# Altium schematic sheet EDU_High-Speed-Design_Overview.SchDoc: Overview
size 431 x 279 mm; Date: not used; ApprovedBy: not used; CheckedBy: not used; Author: not used; DrawnBy: not used; Organization: not used; Address4: not used; SheetNumber: 1; SheetTotal: 26; Time: not used; ImagePath: not used; Application_BuildNumber: not used
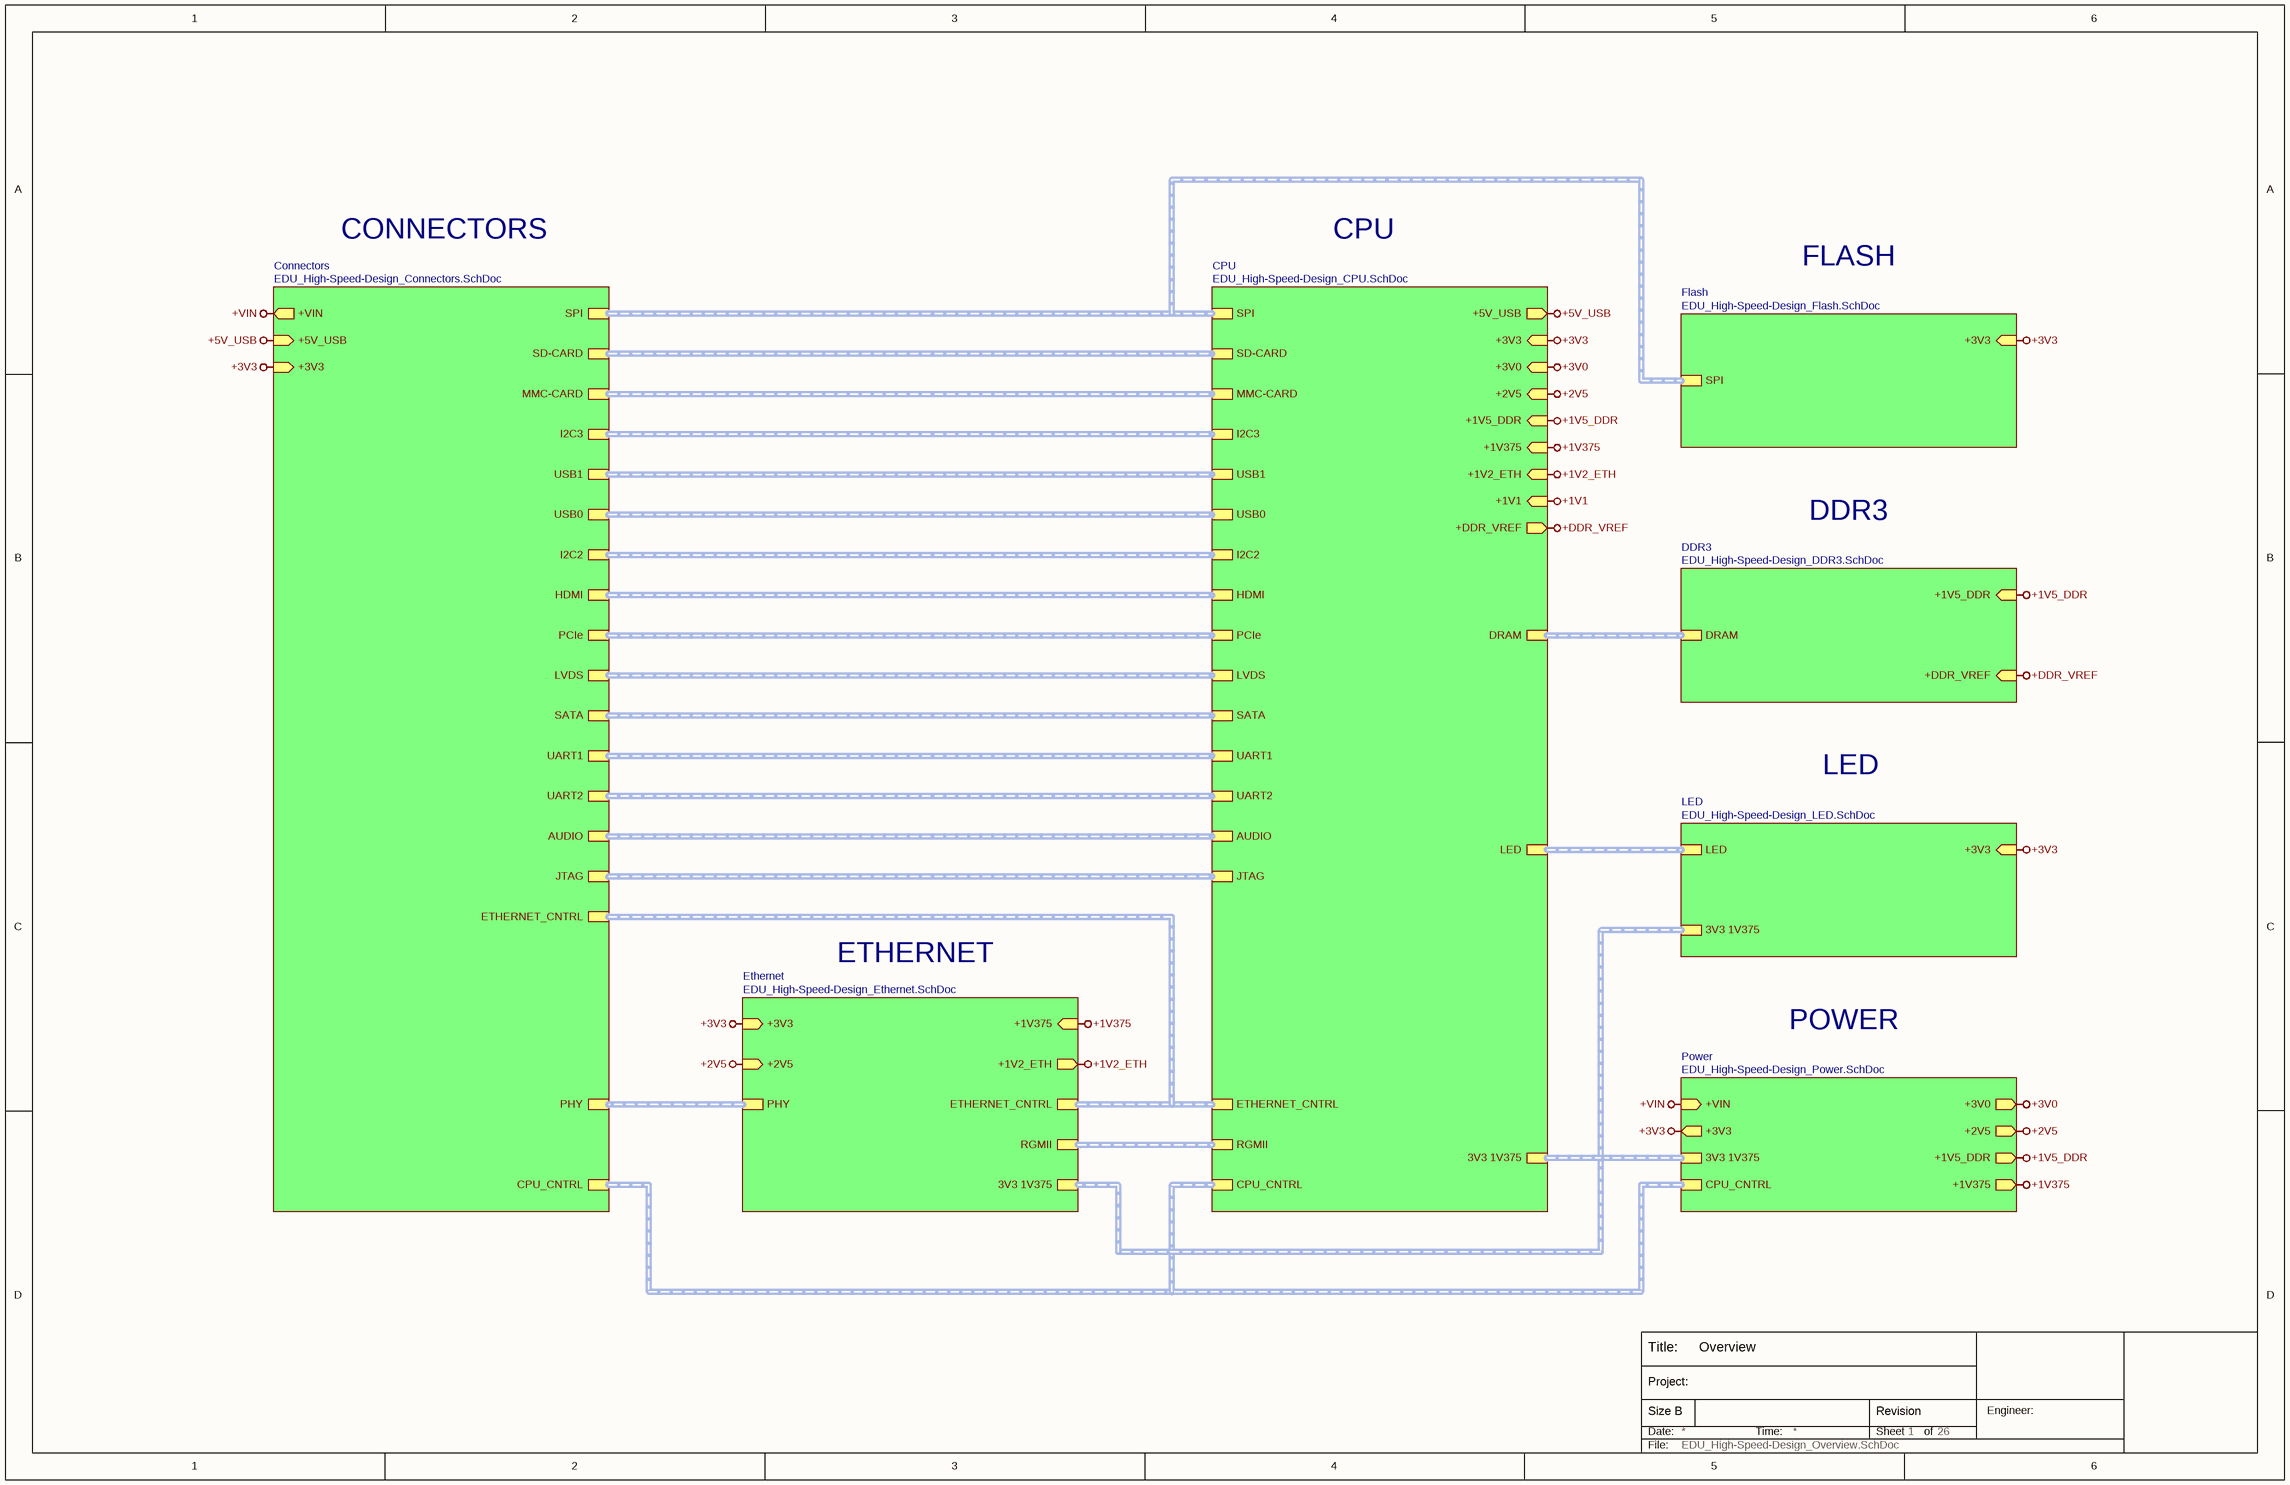
[diagram p0: EDU_High-Speed-Design_Overview.SchDoc]

## Sub-sheets
Connectors = EDU_High-Speed-Design_Connectors.SchDoc: +VIN (out), +5V_USB (in), +3V3 (in), JTAG (harness JTAG), CPU_CNTRL (harness CPU_CNTRL), AUDIO (harness AUDIO), UART2 (harness UART2), UART1 (harness UART1), SATA (harness SATA), LVDS (harness LVDS), PCIe (harness PCIe), HDMI (harness HDMI), I2C2 (harness I2C2), USB0 (harness USB0), USB1 (harness USB1), SPI (harness SPI), I2C3 (harness I2C3), MMC-CARD (harness MMC-CARD), SD-CARD (harness SD-CARD), PHY (harness PHY), ETHERNET_CNTRL (harness ETHERNET_CNTRL)
CPU = EDU_High-Speed-Design_CPU.SchDoc: +3V3 (in), +3V0 (in), +2V5 (in), +1V375 (in), +1V2_ETH (in), RGMII (harness RGMII), JTAG (harness JTAG), CPU_CNTRL (harness CPU_CNTRL), UART1 (harness UART1), UART2 (harness UART2), AUDIO (harness AUDIO), ETHERNET_CNTRL (harness ETHERNET_CNTRL), USB1 (harness USB1), USB0 (harness USB0), LVDS (harness LVDS), I2C3 (harness I2C3), HDMI (harness HDMI), I2C2 (harness I2C2), SATA (harness SATA), PCIe (harness PCIe), DRAM (harness DRAM), MMC-CARD (harness MMC-CARD), SPI (harness SPI), +5V_USB (out), LED (harness LED), +1V1 (in), SD-CARD (harness SD-CARD), +1V5_DDR (in), +DDR_VREF (out), 3V3 1V375 (harness 3V3 1V375)
DDR3 = EDU_High-Speed-Design_DDR3.SchDoc: +1V5_DDR (in), DRAM (harness DRAM), +DDR_VREF (in)
Ethernet = EDU_High-Speed-Design_Ethernet.SchDoc: RGMII (harness RGMII), +3V3 (in), PHY (harness PHY), +2V5 (in), ETHERNET_CNTRL (harness ETHERNET_CNTRL), +1V2_ETH (out), +1V375 (in), 3V3 1V375 (harness 3V3 1V375)
Flash = EDU_High-Speed-Design_Flash.SchDoc: +3V3 (in), SPI (harness SPI)
LED = EDU_High-Speed-Design_LED.SchDoc: +3V3 (in), LED (harness LED), 3V3 1V375 (harness 3V3 1V375)
Power = EDU_High-Speed-Design_Power.SchDoc: +2V5 (out), +VIN (in), +3V3 (out), 3V3 1V375 (harness 3V3 1V375), +3V0 (out), +1V375 (out), +1V5_DDR (out), CPU_CNTRL (harness CPU_CNTRL)

## Nets
+1V1: sheet CPU/+1V1
+1V2_ETH: sheet CPU/+1V2_ETH, sheet Ethernet/+1V2_ETH
+1V5_DDR: sheet CPU/+1V5_DDR, sheet DDR3/+1V5_DDR, sheet Power/+1V5_DDR
+1V375: sheet CPU/+1V375, sheet Ethernet/+1V375, sheet Power/+1V375
+2V5: sheet CPU/+2V5, sheet Ethernet/+2V5, sheet Power/+2V5
+3V0: sheet CPU/+3V0, sheet Power/+3V0
+3V3: sheet CPU/+3V3, sheet Connectors/+3V3, sheet Ethernet/+3V3, sheet Flash/+3V3, sheet Power/+3V3, sheet LED/+3V3
+5V_USB: sheet CPU/+5V_USB, sheet Connectors/+5V_USB
+DDR_VREF: sheet CPU/+DDR_VREF, sheet DDR3/+DDR_VREF
+VIN: sheet Connectors/+VIN, sheet Power/+VIN

## Buses and harness runs
harness sheet Connectors/AUDIO = sheet CPU/AUDIO
harness sheet Connectors/CPU_CNTRL = sheet CPU/CPU_CNTRL = sheet Power/CPU_CNTRL
harness sheet Connectors/ETHERNET_CNTRL = sheet CPU/ETHERNET_CNTRL = sheet Ethernet/ETHERNET_CNTRL
harness sheet Connectors/HDMI = sheet CPU/HDMI
harness sheet Connectors/I2C2 = sheet CPU/I2C2
harness sheet Connectors/I2C3 = sheet CPU/I2C3
harness sheet Connectors/JTAG = sheet CPU/JTAG
harness sheet Connectors/LVDS = sheet CPU/LVDS
harness sheet Connectors/MMC-CARD = sheet CPU/MMC-CARD
harness sheet Connectors/PCIe = sheet CPU/PCIe
harness sheet Connectors/PHY = sheet Ethernet/PHY
harness sheet Connectors/SATA = sheet CPU/SATA
harness sheet Connectors/SD-CARD = sheet CPU/SD-CARD
harness sheet Connectors/SPI = sheet CPU/SPI = sheet Flash/SPI
harness sheet Connectors/UART1 = sheet CPU/UART1
harness sheet Connectors/UART2 = sheet CPU/UART2
harness sheet Connectors/USB0 = sheet CPU/USB0
harness sheet Connectors/USB1 = sheet CPU/USB1
harness sheet CPU/3V3 1V375 = sheet Ethernet/3V3 1V375 = sheet LED/3V3 1V375 = sheet Power/3V3 1V375
harness sheet CPU/DRAM = sheet DDR3/DRAM
harness sheet CPU/LED = sheet LED/LED
harness sheet CPU/RGMII = sheet Ethernet/RGMII

## Notes on the sheet
- CONNECTORS
- CPU
- FLASH
- DDR3
- LED
- ETHERNET
- POWER
- Title:
- Date:
- Size B
- Project:
- Time:
- Sheet
- Revision
- of
- Engineer:
- File: